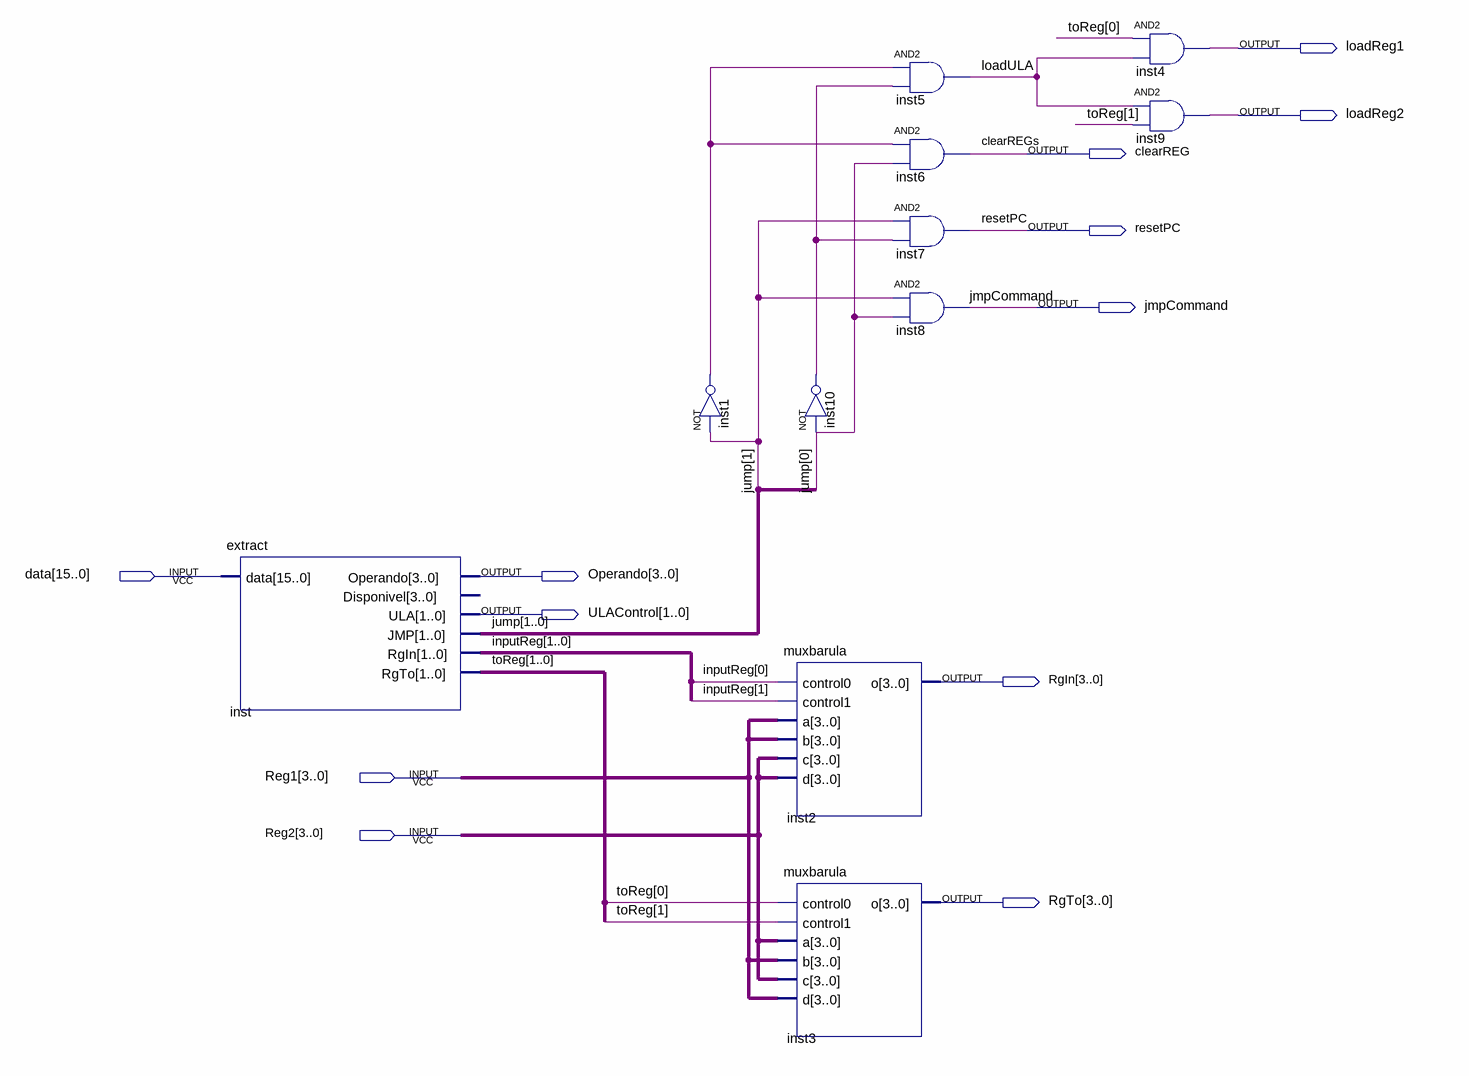
[diagram p0: schematic sheet]
// Quartus schematic UnidadeControle.bdf as structural Verilog: 11 symbols, 12 pins
module UnidadeControle (
  input  [15:0] data,
  input  [3:0] Reg1,
  input  [3:0] Reg2,
  output loadReg1,
  output loadReg2,
  output clearREG,
  output resetPC,
  output jmpCommand,
  output [3:0] Operando,
  output [1:0] ULAControl,
  output [3:0] RgIn,
  output [3:0] RgTo
);

  wire inst1_out, inst10_out, loadULA;
  wire [1:0] inputReg, jump, toReg;

  extract inst (
    .data(data), .Operando(Operando), .ULA(ULAControl), .JMP(jump), .RgIn(inputReg), .RgTo(toReg));  // open: Disponivel
  not inst1 (inst1_out, jump[1]);
  not inst10 (inst10_out, jump[0]);
  muxbarula inst2 (.control0(inputReg[0]), .control1(inputReg[1]), .a(Reg1), .b(Reg1), .c(Reg2), .d(Reg2), .o(RgIn));
  muxbarula inst3 (.control0(toReg[0]), .control1(toReg[1]), .a(Reg2), .b(Reg1), .c(Reg2), .d(Reg1), .o(RgTo));
  and inst5 (loadULA, inst1_out, inst10_out);
  and inst6 (clearREG, inst1_out, jump[0]);
  and inst7 (resetPC, jump[1], inst10_out);
  and inst8 (jmpCommand, jump[1], jump[0]);
  and inst4 (loadReg1, toReg[0], loadULA);
  and inst9 (loadReg2, loadULA, toReg[1]);

  // Other names for the same wires on the sheet: clearREGs = clearREG
endmodule
